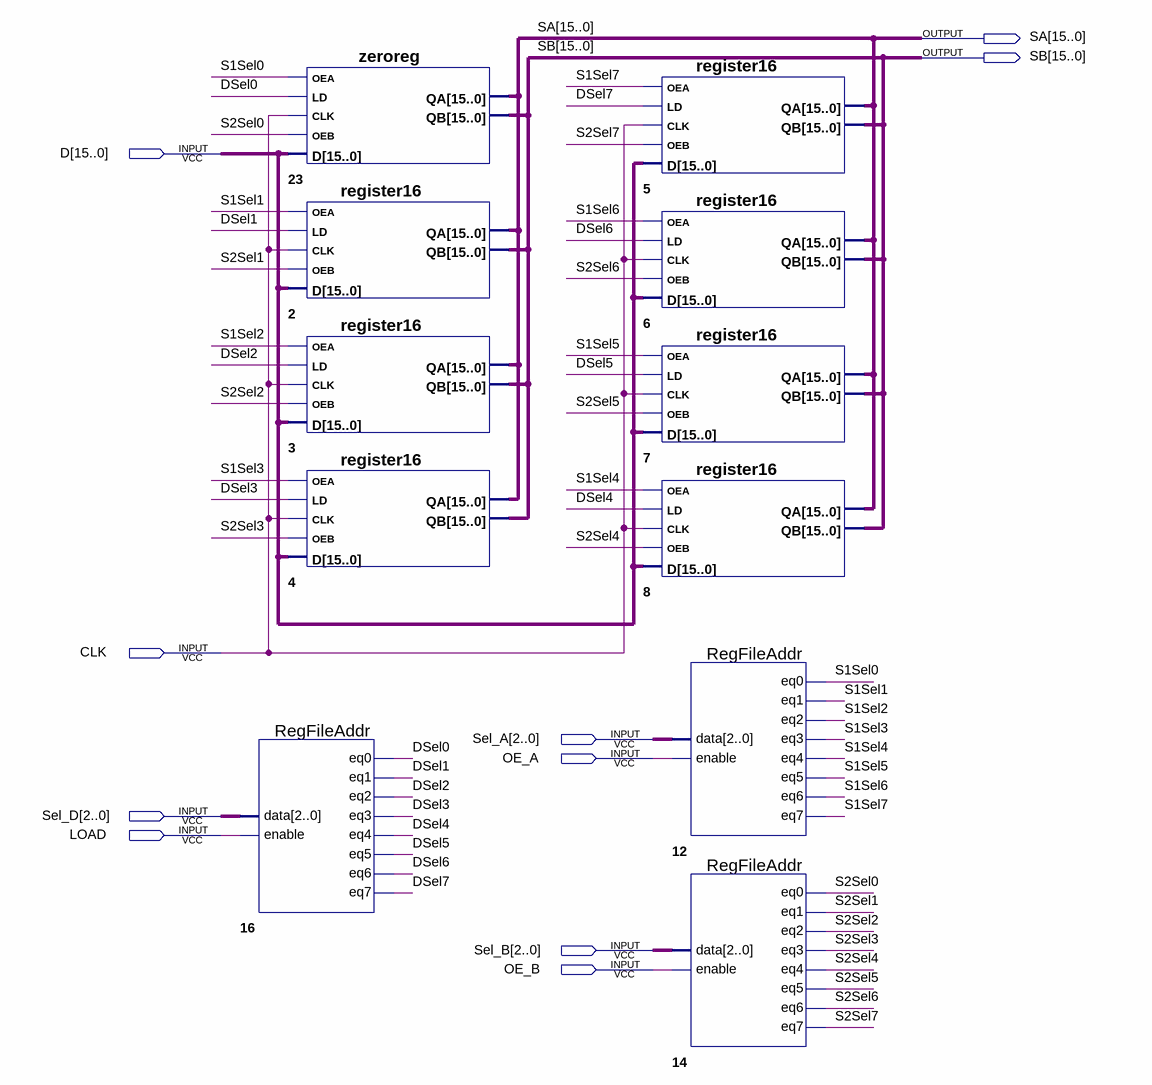
[diagram p0: schematic sheet]
// Quartus schematic registerfile.bdf as structural Verilog: 11 symbols, 10 pins
module registerfile (
  input  [15:0] D,
  input  CLK,
  input  [2:0] Sel_A,
  input  OE_A,
  input  [2:0] Sel_D,
  input  LOAD,
  input  [2:0] Sel_B,
  input  OE_B,
  output [15:0] SA,
  output [15:0] SB
);

  wire DSel0, DSel1, DSel2, DSel3, DSel4, DSel5, DSel6, DSel7, S1Sel0, S1Sel1, S1Sel2, S1Sel3, S1Sel4,
       S1Sel5, S1Sel6, S1Sel7, S2Sel0, S2Sel1, S2Sel2, S2Sel3, S2Sel4, S2Sel5, S2Sel6, S2Sel7;

  RegFileAddr u_16 (
    .data(Sel_D), .enable(LOAD), .eq0(DSel0), .eq1(DSel1), .eq2(DSel2), .eq3(DSel3), .eq4(DSel4),
    .eq5(DSel5), .eq6(DSel6), .eq7(DSel7));
  zeroreg u_23 (.OEA(S1Sel0), .LD(DSel0), .CLK(CLK), .OEB(S2Sel0), .D(D), .QA(SA), .QB(SB));
  register16 u_2 (.OEA(S1Sel1), .LD(DSel1), .CLK(CLK), .OEB(S2Sel1), .D(D), .QA(SA), .QB(SB));
  register16 u_3 (.OEA(S1Sel2), .LD(DSel2), .CLK(CLK), .OEB(S2Sel2), .D(D), .QA(SA), .QB(SB));
  register16 u_4 (.OEA(S1Sel3), .LD(DSel3), .CLK(CLK), .OEB(S2Sel3), .D(D), .QA(SA), .QB(SB));
  register16 u_5 (.OEA(S1Sel7), .LD(DSel7), .CLK(CLK), .OEB(S2Sel7), .D(D), .QA(SA), .QB(SB));
  register16 u_6 (.OEA(S1Sel6), .LD(DSel6), .CLK(CLK), .OEB(S2Sel6), .D(D), .QA(SA), .QB(SB));
  register16 u_7 (.OEA(S1Sel5), .LD(DSel5), .CLK(CLK), .OEB(S2Sel5), .D(D), .QA(SA), .QB(SB));
  register16 u_8 (.OEA(S1Sel4), .LD(DSel4), .CLK(CLK), .OEB(S2Sel4), .D(D), .QA(SA), .QB(SB));
  RegFileAddr u_12 (
    .data(Sel_A), .enable(OE_A), .eq0(S1Sel0), .eq1(S1Sel1), .eq2(S1Sel2), .eq3(S1Sel3), .eq4(S1Sel4),
    .eq5(S1Sel5), .eq6(S1Sel6), .eq7(S1Sel7));
  RegFileAddr u_14 (
    .data(Sel_B), .enable(OE_B), .eq0(S2Sel0), .eq1(S2Sel1), .eq2(S2Sel2), .eq3(S2Sel3), .eq4(S2Sel4),
    .eq5(S2Sel5), .eq6(S2Sel6), .eq7(S2Sel7));
endmodule
